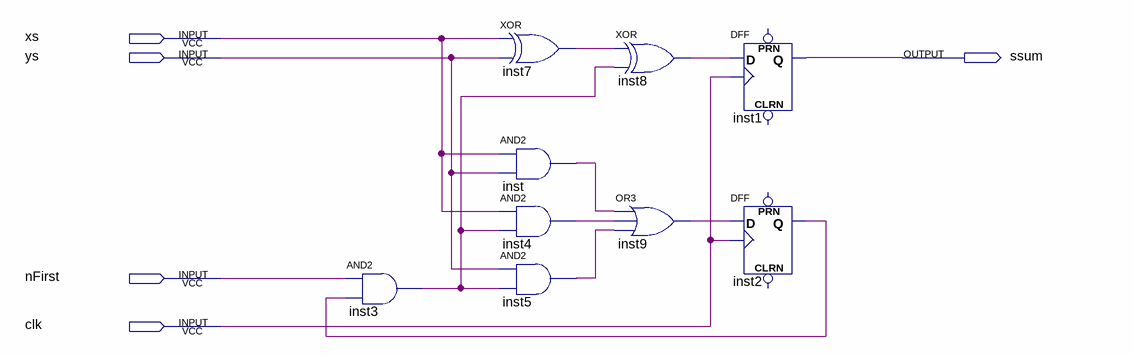
[diagram p0: schematic sheet]
// Quartus schematic summator.bdf as structural Verilog: 9 symbols, 5 pins
module summator (
  input  xs,
  input  ys,
  input  nFirst,
  input  clk,
  output ssum
);

  wire inst2_q, inst3_out, inst4_out, inst5_out, inst7_out, inst8_out, inst9_out, inst_out;

  and inst3 (inst3_out, nFirst, inst2_q);
  xor inst7 (inst7_out, xs, ys);
  and inst (inst_out, xs, ys);
  and inst4 (inst4_out, xs, inst3_out);
  and inst5 (inst5_out, ys, inst3_out);
  xor inst8 (inst8_out, inst7_out, inst3_out);
  or inst9 (inst9_out, inst_out, inst4_out, inst5_out);
  DFF inst1 (.CLK(clk), .D(inst8_out), .Q(ssum));  // open: CLRN, PRN
  DFF inst2 (.CLK(clk), .D(inst9_out), .Q(inst2_q));  // open: CLRN, PRN
endmodule
